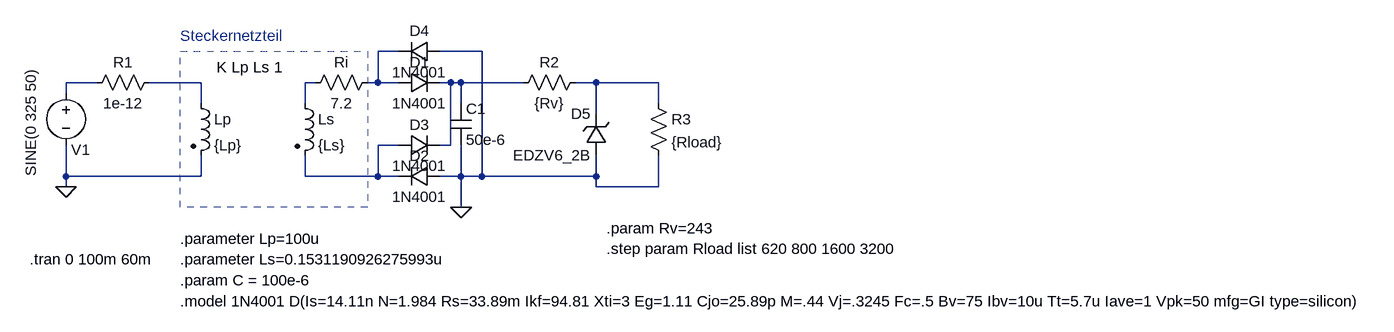
[diagram p0: schematic 103_lec_exercise_diode_bruecke_parallelStabi.asc]
103_lec_exercise_diode_bruecke_parallelStabi.asc, the LTspice schematic file:
Version 4
SHEET 1 2120 680
WIRE 416 0 384 0
WIRE 544 0 480 0
WIRE -48 48 -96 48
WIRE 112 48 32 48
WIRE 288 48 272 48
WIRE 384 48 384 0
WIRE 384 48 368 48
WIRE 416 48 384 48
WIRE 496 48 480 48
WIRE 512 48 496 48
WIRE 608 48 512 48
WIRE 720 48 688 48
WIRE 816 48 720 48
WIRE -96 64 -96 48
WIRE 112 80 112 48
WIRE 272 80 272 48
WIRE 512 80 512 48
WIRE 816 80 816 48
WIRE 720 96 720 48
WIRE 416 144 384 144
WIRE 496 144 496 48
WIRE 496 144 480 144
WIRE -96 192 -96 144
WIRE 112 192 112 160
WIRE 112 192 -96 192
WIRE 272 192 272 160
WIRE 384 192 384 144
WIRE 384 192 272 192
WIRE 416 192 384 192
WIRE 512 192 512 144
WIRE 512 192 480 192
WIRE 544 192 544 0
WIRE 544 192 512 192
WIRE 720 192 720 160
WIRE 720 192 544 192
WIRE -96 208 -96 192
WIRE 720 208 720 192
WIRE 816 208 816 160
WIRE 816 208 720 208
WIRE 512 240 512 192
FLAG -96 208 0
FLAG 512 240 0
SYMBOL voltage -96 48 R0
WINDOW 0 8 103 Left 2
WINDOW 3 -54 144 VLeft 2
WINDOW 123 0 0 Left 2
WINDOW 39 0 0 Left 2
SYMATTR InstName V1
SYMATTR Value SINE(0 325 50)
SYMBOL ind2 96 64 R0
SYMATTR InstName Lp
SYMATTR Value {Lp}
SYMATTR Type ind
SYMBOL ind2 256 64 R0
SYMATTR InstName Ls
SYMATTR Value {Ls}
SYMATTR Type ind
SYMBOL res 48 32 R90
WINDOW 0 0 56 VBottom 2
WINDOW 3 32 56 VTop 2
SYMATTR InstName R1
SYMATTR Value 1e-12
SYMBOL res 384 32 R90
WINDOW 0 0 56 VBottom 2
WINDOW 3 32 56 VTop 2
SYMATTR InstName Ri
SYMATTR Value 7.2
SYMBOL diode 416 64 R270
WINDOW 0 32 32 VTop 2
WINDOW 3 0 32 VBottom 2
SYMATTR InstName D1
SYMATTR Value 1N4001
SYMBOL cap 496 80 R0
SYMATTR InstName C1
SYMATTR Value 50e-6
SYMBOL diode 480 176 R90
WINDOW 0 0 32 VBottom 2
WINDOW 3 32 32 VTop 2
SYMATTR InstName D2
SYMATTR Value 1N4001
SYMBOL diode 416 160 R270
WINDOW 0 32 32 VTop 2
WINDOW 3 0 32 VBottom 2
SYMATTR InstName D3
SYMATTR Value 1N4001
SYMBOL diode 480 -16 R90
WINDOW 0 0 32 VBottom 2
WINDOW 3 32 32 VTop 2
SYMATTR InstName D4
SYMATTR Value 1N4001
SYMBOL res 704 32 R90
WINDOW 0 0 56 VBottom 2
WINDOW 3 32 56 VTop 2
SYMATTR InstName R2
SYMATTR Value {Rv}
SYMBOL zener 736 160 R180
WINDOW 0 24 64 Left 2
WINDOW 3 24 0 Left 2
SYMATTR InstName D5
SYMATTR Value EDZV6_2B
SYMATTR Description Diode
SYMATTR Type diode
SYMBOL res 800 64 R0
SYMATTR InstName R3
SYMATTR Value {Rload}
TEXT 136 24 Left 2 !K Lp Ls 1
TEXT 80 -24 Left 2 ;Steckernetzteil
TEXT 80 288 Left 2 !.parameter Lp=100u
TEXT 80 320 Left 2 !.parameter Ls=0.1531190926275993u
TEXT -152 320 Left 2 !.tran 0 100m 60m
TEXT 80 352 Left 2 !.param C = 100e-6
TEXT 80 384 Left 2 !.model 1N4001 D(Is=14.11n N=1.984 Rs=33.89m Ikf=94.81 Xti=3 Eg=1.11 Cjo=25.89p M=.44 Vj=.3245 Fc=.5 Bv=75 Ibv=10u Tt=5.7u Iave=1 Vpk=50 mfg=GI type=silicon)
TEXT 736 272 Left 2 !.param Rv=243\n.step param Rload list 620 800 1600 3200
RECTANGLE Normal 368 240 80 0 2

The netlist it stands for:
* 103_lec_exercise_diode_bruecke_parallelStabi.asc
V1 N002 0 SINE(0 325 50)
Lp N003 0 {Lp}
Ls N004 N007 {Ls}
R1 N003 N002 1e-12
Ri N001 N004 7.2
D1 N001 N005 1N4001
C1 N005 0 50e-6
D2 0 N007 1N4001
D3 N007 N005 1N4001
D4 0 N001 1N4001
R2 N006 N005 {Rv}
D5 0 N006 EDZV6_2B
R3 N006 0 {Rload}
.model D D
.lib standard.dio
K Lp Ls 1
* Steckernetzteil
.parameter Lp=100u
.parameter Ls=0.1531190926275993u
.tran 0 100m 60m
.param C = 100e-6
.model 1N4001 D(Is=14.11n N=1.984 Rs=33.89m Ikf=94.81 Xti=3 Eg=1.11 Cjo=25.89p M=.44 Vj=.3245 Fc=.5 Bv=75 Ibv=10u Tt=5.7u Iave=1 Vpk=50 mfg=GI type=silicon)
.param Rv=243
.step param Rload list 620 800 1600 3200
.backanno
.end